# Altium project Timing Display Board v1.1.PrjPcb (part 1 of 2)
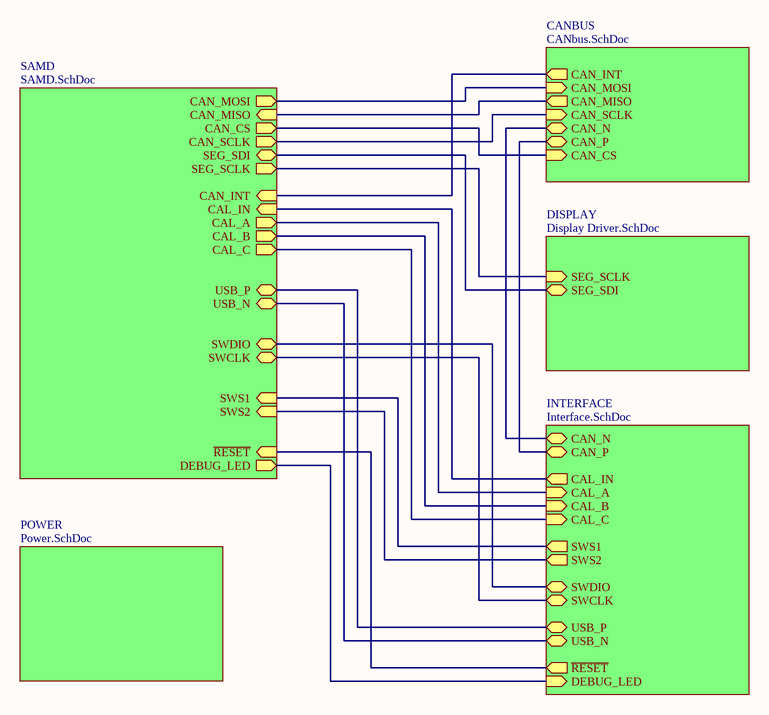
[diagram p0: Timing Display Top.SchDoc]
7 sheets, 197 parts. Net scope: hierarchical (ports join the sheet entries above them; power ports are global).
Board file: Timing Display.PcbDoc
Sheets:
  Timing Display Top.SchDoc
    SAMD = SAMD.SchDoc
    POWER = Power.SchDoc
    DISPLAY = Display Driver.SchDoc
      0 = Display.SchDoc
      1 = Display.SchDoc
      2 = Display.SchDoc
      3 = Display.SchDoc
      4 = Display.SchDoc
      5 = Display.SchDoc
      6 = Display.SchDoc
      7 = Display.SchDoc
    INTERFACE = Interface.SchDoc
    CANBUS = CANbus.SchDoc

## Sheet Timing Display Top.SchDoc
size OrCAD C; SheetNumber: 1; SheetTotal: 7

### Sub-sheets
CANBUS = CANbus.SchDoc: CAN_INT (out), CAN_MOSI (in), CAN_MISO (out), CAN_SCLK (in), CAN_CS (in), CAN_N (bidir), CAN_P (bidir)
DISPLAY = Display Driver.SchDoc: SEG_SCLK (in), SEG_SDI (bidir)
INTERFACE = Interface.SchDoc: CAL_C (in), ~{RESET} (out), CAL_A (in), SWDIO (bidir), CAL_B (in), SWCLK (bidir), CAL_IN (out), SWS2 (out), SWS1 (out), CAN_N (bidir), CAN_P (bidir), USB_N (bidir), USB_P (bidir), DEBUG_LED (in)
POWER = Power.SchDoc: no entries
SAMD = SAMD.SchDoc: CAL_IN (in), SWS2 (in), SWCLK (bidir), CAL_C (out), CAL_B (out), SWS1 (in), SEG_SDI (bidir), SWDIO (bidir), SEG_SCLK (out), ~{RESET} (in), CAL_A (out), CAN_MISO (in), CAN_SCLK (out), CAN_CS (out), CAN_MOSI (out), CAN_INT (in), USB_P (bidir), USB_N (bidir), DEBUG_LED (out)

### Nets
CAL_A: sheet SAMD/CAL_A, sheet INTERFACE/CAL_A
CAL_B: sheet SAMD/CAL_B, sheet INTERFACE/CAL_B
CAL_C: sheet SAMD/CAL_C, sheet INTERFACE/CAL_C
CAL_IN: sheet SAMD/CAL_IN, sheet INTERFACE/CAL_IN
CAN_CS: sheet SAMD/CAN_CS, sheet CANBUS/CAN_CS
CAN_INT: sheet SAMD/CAN_INT, sheet CANBUS/CAN_INT
CAN_MISO: sheet SAMD/CAN_MISO, sheet CANBUS/CAN_MISO
CAN_MOSI: sheet SAMD/CAN_MOSI, sheet CANBUS/CAN_MOSI
CAN_N: sheet INTERFACE/CAN_N, sheet CANBUS/CAN_N
CAN_P: sheet INTERFACE/CAN_P, sheet CANBUS/CAN_P
CAN_SCLK: sheet SAMD/CAN_SCLK, sheet CANBUS/CAN_SCLK
DEBUG_LED: sheet SAMD/DEBUG_LED, sheet INTERFACE/DEBUG_LED
~{RESET}: sheet SAMD/~{RESET}, sheet INTERFACE/~{RESET}
SCLK: sheet SAMD/SEG_SCLK, sheet DISPLAY/SEG_SCLK
SDI: sheet SAMD/SEG_SDI, sheet DISPLAY/SEG_SDI
SWCLK: sheet SAMD/SWCLK, sheet INTERFACE/SWCLK
SWDIO: sheet SAMD/SWDIO, sheet INTERFACE/SWDIO
SWS1: sheet SAMD/SWS1, sheet INTERFACE/SWS1
SWS2: sheet SAMD/SWS2, sheet INTERFACE/SWS2
USB_N: sheet SAMD/USB_N, sheet INTERFACE/USB_N
USB_P: sheet SAMD/USB_P, sheet INTERFACE/USB_P

## Sheet SAMD.SchDoc
size OrCAD C; SheetNumber: 5; SheetTotal: 7
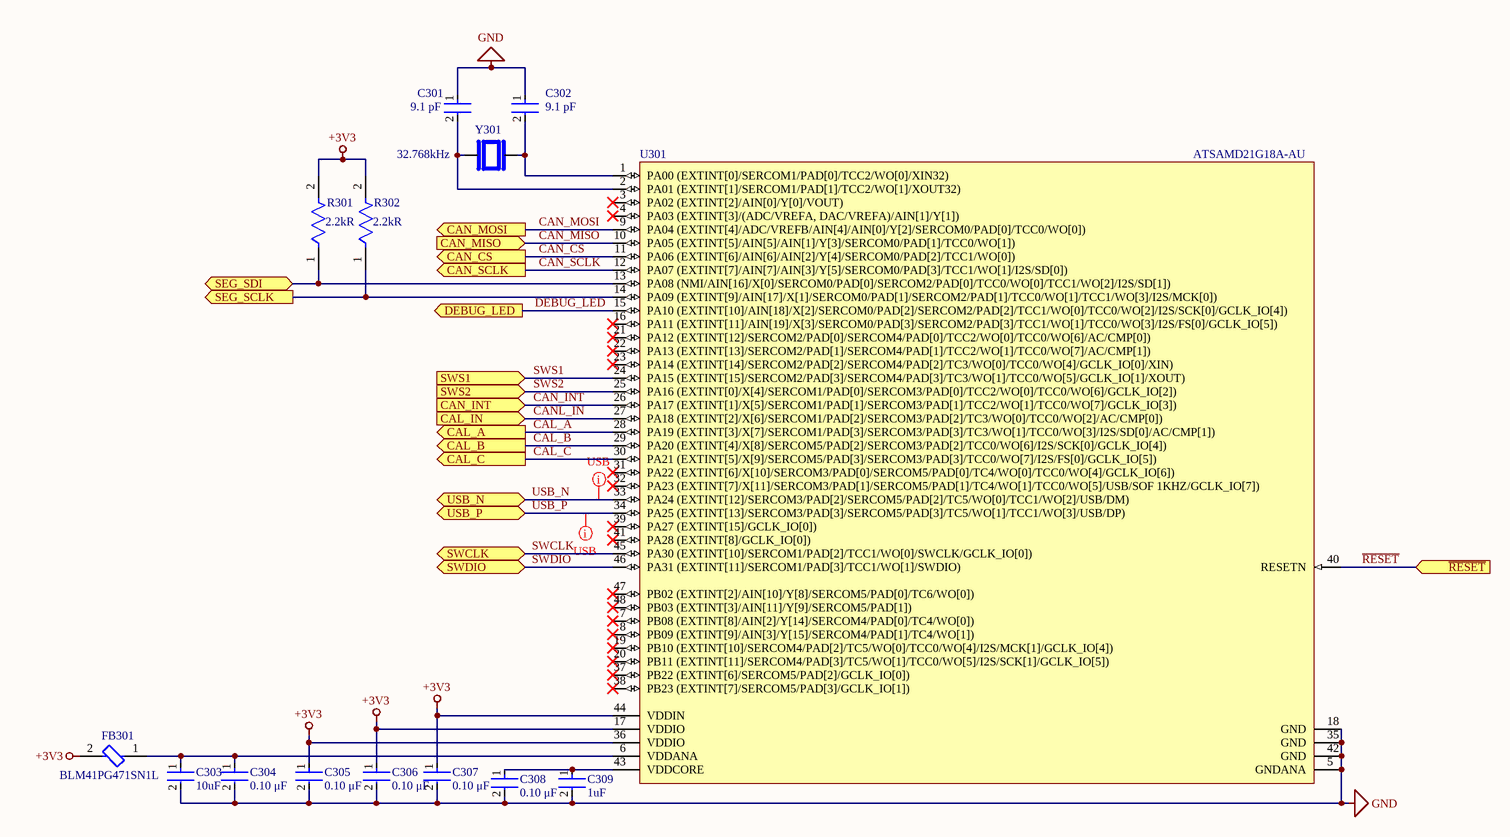
[diagram p1: SAMD.SchDoc]

### Parts
C301  Capacitance: 9.1 pF  [FP-C0402-BB-MFG]  (hidden comment: C0402C919C5GAC7867)
C302  Capacitance: 9.1 pF  [FP-C0402-BB-MFG]  (hidden comment: C0402C919C5GAC7867)
C303  Capacitance: 10uF  [FP-C1206C-EH-MFG]  (hidden comment: C1206C106K4RACAUTO)
C304  Capacitance: 0.10 μF  [FP-C0603C-CF-MFG]  (hidden comment: C0603C104K5RACAUTO)
C305  Capacitance: 0.10 μF  [FP-C0603C-CF-MFG]  (hidden comment: C0603C104K5RACAUTO)
C306  Capacitance: 0.10 μF  [FP-C0603C-CF-MFG]  (hidden comment: C0603C104K5RACAUTO)
C307  Capacitance: 0.10 μF  [FP-C0603C-CF-MFG]  (hidden comment: C0603C104K5RACAUTO)
C308  Capacitance: 0.10 μF  [FP-C0603C-CF-MFG]  (hidden comment: C0603C104K5RACAUTO)
C309  Capacitance: 1uF  [FP-C0603C-CJ-MFG]  (hidden comment: C0603C105K4RACAUTO)
FB301  BLM41PG471SN1L  [FP-BLM41-0_2-a1_2-IPC_B]
R301  Resistance: 2.2kR  [FP-CRCW0805-e3-IPC_B]  (hidden comment: CRCW08052K20FKEA)
R302  Resistance: 2.2kR  [FP-CRCW0805-e3-IPC_B]  (hidden comment: CRCW08052K20FKEA)
U301  ATSAMD21G18A-AU  [ATML-TQFP48_M]
Y301  value 32.768kHz  [XTAL_MS1V-T1K-32.768KHZ-9PF-20PPM-TA-QC-AU]  (hidden comment: MS1V-T1K-32.768KHZ-9PF-20PPM-TA-QC-AU)

### Ports
CAL_A (out), CAL_B (out), CAL_C (out), CAL_IN (in), CAN_CS (out), CAN_INT (in), CAN_MISO (in), CAN_MOSI (out), CAN_SCLK (out), DEBUG_LED (out), SEG_SCLK (out), SEG_SDI (bidir), SWCLK (bidir), SWDIO (bidir), SWS1 (in), SWS2 (in), USB_N (bidir), USB_P (bidir), ~{RESET} (in)

### Nets
+3V3: C305.1 C306.1 C307.1 FB301.2 R301.2 R302.2 U301.17(VDDIO) U301.36(VDDIO) U301.44(VDDIN)
GND: C301.1 C302.1 C303.2 C304.2 C305.2 C306.2 C307.2 C308.2 C309.2 U301.5(GNDANA) U301.18(GND) U301.35(GND) U301.42(GND)
CAL_A: U301.28(PA19_(EXTINT[3]/X[7]/SERCOM1/PAD[3]/SERCOM3/PAD[3]/TC3/WO[1]/TCC0/WO[3]/I2S/SD[0]/AC/CMP[1])) ; port CAL_A
CAL_B: U301.29(PA20_(EXTINT[4]/X[8]/SERCOM5/PAD[2]/SERCOM3/PAD[2]/TCC0/WO[6]/I2S/SCK[0]/GCLK_IO[4])) ; port CAL_B
CAL_C: U301.30(PA21_(EXTINT[5]/X[9]/SERCOM5/PAD[3]/SERCOM3/PAD[3]/TCC0/WO[7]/I2S/FS[0]/GCLK_IO[5])) ; port CAL_C
CAN_CS: U301.11(PA06_(EXTINT[6]/AIN[6]/AIN[2]/Y[4]/SERCOM0/PAD[2]/TCC1/WO[0])) ; port CAN_CS
CAN_INT: U301.26(PA17_(EXTINT[1]/X[5]/SERCOM1/PAD[1]/SERCOM3/PAD[1]/TCC2/WO[1]/TCC0/WO[7]/GCLK_IO[3])) ; port CAN_INT
CAN_MISO: U301.10(PA05_(EXTINT[5]/AIN[5]/AIN[1]/Y[3]/SERCOM0/PAD[1]/TCC0/WO[1])) ; port CAN_MISO
CAN_MOSI: U301.9(PA04_(EXTINT[4]/ADC/VREFB/AIN[4]/AIN[0]/Y[2]/SERCOM0/PAD[0]/TCC0/WO[0])) ; port CAN_MOSI
CAN_SCLK: U301.12(PA07_(EXTINT[7]/AIN[7]/AIN[3]/Y[5]/SERCOM0/PAD[3]/TCC1/WO[1]/I2S/SD[0])) ; port CAN_SCLK
CANL_IN: U301.27(PA18_(EXTINT[2]/X[6]/SERCOM1/PAD[2]/SERCOM3/PAD[2]/TC3/WO[0]/TCC0/WO[2]/AC/CMP[0])) ; port CAL_IN  [project net CAL_IN]
DEBUG_LED: U301.15(PA10_(EXTINT[10]/AIN[18]/X[2]/SERCOM0/PAD[2]/SERCOM2/PAD[2]/TCC1/WO[0]/TCC0/WO[2]/I2S/SCK[0]/GCLK_IO[4])) ; port DEBUG_LED
~{RESET}: U301.40(RESETN) ; port ~{RESET}
SCLK: R302.1 U301.14(PA09_(EXTINT[9]/AIN[17]/X[1]/SERCOM0/PAD[1]/SERCOM2/PAD[1]/TCC0/WO[1]/TCC1/WO[3]/I2S/MCK[0])) ; port SEG_SCLK
SDI: R301.1 U301.13(PA08_(NMI/AIN[16]/X[0]/SERCOM0/PAD[0]/SERCOM2/PAD[0]/TCC0/WO[0]/TCC1/WO[2]/I2S/SD[1])) ; port SEG_SDI
SWCLK: U301.45(PA30_(EXTINT[10]/SERCOM1/PAD[2]/TCC1/WO[0]/SWCLK/GCLK_IO[0])) ; port SWCLK
SWDIO: U301.46(PA31_(EXTINT[11]/SERCOM1/PAD[3]/TCC1/WO[1]/SWDIO)) ; port SWDIO
SWS1: U301.24(PA15_(EXTINT[15]/SERCOM2/PAD[3]/SERCOM4/PAD[3]/TC3/WO[1]/TCC0/WO[5]/GCLK_IO[1]/XOUT)) ; port SWS1
SWS2: U301.25(PA16_(EXTINT[0]/X[4]/SERCOM1/PAD[0]/SERCOM3/PAD[0]/TCC2/WO[0]/TCC0/WO[6]/GCLK_IO[2])) ; port SWS2
USB_N: U301.33(PA24_(EXTINT[12]/SERCOM3/PAD[2]/SERCOM5/PAD[2]/TC5/WO[0]/TCC1/WO[2]/USB/DM)) ; port USB_N
USB_P: U301.34(PA25_(EXTINT[13]/SERCOM3/PAD[3]/SERCOM5/PAD[3]/TC5/WO[1]/TCC1/WO[3]/USB/DP)) ; port USB_P
NetC301_2: C301.2 U301.2(PA01_(EXTINT[1]/SERCOM1/PAD[1]/TCC2/WO[1]/XOUT32)) Y301.1
NetC302_2: C302.2 U301.1(PA00_(EXTINT[0]/SERCOM1/PAD[0]/TCC2/WO[0]/XIN32)) Y301.2
NetC303_1: C303.1 C304.1 FB301.1 U301.6(VDDANA)
NetC308_1: C308.1 C309.1 U301.43(VDDCORE)

Not connected (* = marked no-connect by the designer): U301 3(PA02_(EXTINT[2]/AIN[0]/Y[0]/VOUT))* 4(PA03_(EXTINT[3]/(ADC/VREFA,_DAC/VREFA)/AIN[1]/Y[1]))* 7(PB08_(EXTINT[8]/AIN[2]/Y[14]/SERCOM4/PAD[0]/TC4/WO[0]))* 8(PB09_(EXTINT[9]/AIN[3]/Y[15]/SERCOM4/PAD[1]/TC4/WO[1]))* 16(PA11_(EXTINT[11]/AIN[19]/X[3]/SERCOM0/PAD[3]/SERCOM2/PAD[3]/TCC1/WO[1]/TCC0/WO[3]/I2S/FS[0]/GCLK_IO[5]))* 19(PB10_(EXTINT[10]/SERCOM4/PAD[2]/TC5/WO[0]/TCC0/WO[4]/I2S/MCK[1]/GCLK_IO[4]))* 20(PB11_(EXTINT[11]/SERCOM4/PAD[3]/TC5/WO[1]/TCC0/WO[5]/I2S/SCK[1]/GCLK_IO[5]))* 21(PA12_(EXTINT[12]/SERCOM2/PAD[0]/SERCOM4/PAD[0]/TCC2/WO[0]/TCC0/WO[6]/AC/CMP[0]))* 22(PA13_(EXTINT[13]/SERCOM2/PAD[1]/SERCOM4/PAD[1]/TCC2/WO[1]/TCC0/WO[7]/AC/CMP[1]))* 23(PA14_(EXTINT[14]/SERCOM2/PAD[2]/SERCOM4/PAD[2]/TC3/WO[0]/TCC0/WO[4]/GCLK_IO[0]/XIN))* 31(PA22_(EXTINT[6]/X[10]/SERCOM3/PAD[0]/SERCOM5/PAD[0]/TC4/WO[0]/TCC0/WO[4]/GCLK_IO[6]))* 32(PA23_(EXTINT[7]/X[11]/SERCOM3/PAD[1]/SERCOM5/PAD[1]/TC4/WO[1]/TCC0/WO[5]/USB/SOF_1KHZ/GCLK_IO[7]))* 37(PB22_(EXTINT[6]/SERCOM5/PAD[2]/GCLK_IO[0]))* 38(PB23_(EXTINT[7]/SERCOM5/PAD[3]/GCLK_IO[1]))* 39(PA27_(EXTINT[15]/GCLK_IO[0]))* 41(PA28_(EXTINT[8]/GCLK_IO[0]))* 47(PB02_(EXTINT[2]/AIN[10]/Y[8]/SERCOM5/PAD[0]/TC6/WO[0]))* 48(PB03_(EXTINT[3]/AIN[11]/Y[9]/SERCOM5/PAD[1]))*

### Layout directives
differential pair: USB_N, USB_P

### Library data of the parts
C301 C302 = CMP-03020-023776-1: C0402 9.1 pF C0G 0.25 pF 50 V; Manufacturer: Kemet; Voltage Rating: 50 V; Material: Ceramic; Temperature Coefficient: 15%; Value: 9.1 pF; Tolerance: 0.25 pF; Height: 0.55mm; Octopart: https://octopart.com/c0402c919c5gac7867-kemet-1610064; Category: Cap; Device Class L3: Ceramic Capacitors; Temperature Range Low: -55°C; RoHS: TRUE; Temperature Characteristic: C0G; ComponentLink2URL: https://content.kemet.com/datasheets/KEM_C1002_X7R_SMD.pdf; Lead Free: Yes; Temperature Range High: +125°C; Device Class L1: Passive Components; Manufacturer Part Number: C0402C919C5GAC7867; Device Class L2: Capacitors; ComponentLink2Description: Datasheet; Temperature: -55°C to +125°C; Automotive: No; Ipc Land Pattern Name: CAPC10050X50; Package: C0402-BB
C303 = CMP-03020-003375-1: CAP CER 10UF 16V X7R 1206; Manufacturer: Kemet; Material: Ceramic; Temperature Coefficient: 15%; Tolerance: 10%; Automotive Grade: Grade 1; Manufacturer Part Number: C1206C106K4RACAUTO; Digikey Description: CAP CER 10UF 16V X7R 1206; RoHS: TRUE; Temperature Range Low: -55°C; Ipc Land Pattern Name: CAPC320160X160; Category: Cap; Mouser Description: Multilayer Ceramic Capacitors MLCC - SMD/SMT 10uF 16V 10% AUTO; Device Class L1: Passive Components; Automotive: Yes; ComponentLink2Description: Datasheet; Octopart: https://octopart.com/c1206c106k4racauto-kemet-20072893; Package: C1206C-EH; Temperature: -55°C to +125°C; Device Class L3: Ceramic Capacitors; Device Class L2: Capacitors; Temperature Range High: +125°C; Value: 10uF; Lead Free: Yes; Height: 1.8mm; Temperature Characteristic: X7R; ComponentLink2URL: https://content.kemet.com/datasheets/KEM_C1023_X7R_AUTO_SMD.pdf; Voltage Rating: 16V
C304-C308 = CMP-2006-03060-2: CAP CER 0.1UF 50V X7R 0603; Manufacturer: KEMET; Tolerance: 0.1; Material: Ceramic; Value: 0.10 μF; Automotive Grade: Grade 1; Temperature Coefficient: 30ppm/°C; RoHS: TRUE; Temperature Range Low: -55°C; Automotive: Yes; Octopart: https://octopart.com/c0603c104k5racauto-kemet-12563741; Temperature Characteristic: X7R; Category: Cap; Voltage Rating: 50 V; Mouser Description: Multilayer Ceramic Capacitors MLCC - SMD/SMT 0.1uF 50volts 10% X7R AUTO; ComponentLink2Description: Datasheet; Device Class L2: Capacitors; Digikey Description: CAP CER 0.1UF 50V X7R 0603; Manufacturer Part Number: C0603C104K5RACAUTO; ComponentLink2URL: https://api.kemet.com/component-edge/download/datasheet/C0603C100J5GACAUTO.pdf; Lead Free: Yes; Height: 0.87mm; Device Class L3: Ceramic Capacitors; Device Class L1: Passive Components; Temperature Range High: +125°C; Package: C0603C-CF; Temperature: -55°C to +125°C
C309 = CMP-03020-014193-1: CAP CER 0603 1UF 16V X7R 10%; Manufacturer: KEMET; Temperature Coefficient: 15%; Automotive Grade: Grade 1; Material: Ceramic; Digikey Description: CAP CER 0603 1UF 16V X7R 10%; Octopart: https://octopart.com/c0603c105k4racauto-kemet-91328491; Package: C0603C-CJ; ComponentLink2Description: Datasheet; Mouser Description: Cap Ceramic 1uF 16V X7R 10% Pad SMD 0603 125C Automotive T/R; Automotive: Yes; Tolerance: 10%; Manufacturer Part Number: C0603C105K4RACAUTO; Lead Free: Yes; Temperature: -55°C to +125°C; ComponentLink2URL: https://content.kemet.com/datasheets/KEM_C1023_X7R_AUTO_SMD.pdf; Temperature Range Low: -55°C; Ipc Land Pattern Name: CAPC16080X80; Device Class L1: Passive Components; Temperature Characteristic: X7R; Device Class L2: Capacitors; Height: 0.95mm; Device Class L3: Ceramic Capacitors; RoHS: TRUE; Category: Cap; Temperature Range High: +125°C; Value: 1uF; Voltage Rating: 16V
FB301 = CMP-0686-00760-3: Ferrite Bead, 1806, 470Ω @ 100MHz, 25%, 0.05Ω, 2A; Material: Steel; Number of Circuits: 1; Shielding: Unshielded; DC Resistance (DCR): 50mR; Impedance: 470R; Min Operating Temperature: -55°C; Case/Package: 1806; Packaging: Tape and Reel; DC Current: 2A; Frequency: 100MHz; Length: 4.5mm; Max Operating Temperature: 125°C; Package Quantity: 1; Max Current Rating: 2A; Radiation Hardening: No; RoHS Compliant: Yes; Lead Free: Lead Free; Height: 1.6mm; Test Frequency: 100MHz; Series: BLM41P; Width: 1.6mm; Core Material: Ferrite; Case Code (Imperial): 1806; Termination: SMD/SMT; Tolerance: 25%; Number of Pins: 2; Number of Lines: 1; Case Code (Metric): 4516; Current Rating: 2A; Max DC Current: 2A; DC Resistance-Max: 50mR; Depth: 1.6mm; Military Standard: Not
R301 R302 = CMP-2001-03760-2: RES Thick Film, 2.2kΩ, 1%, 0.125W, 100ppm/°C, 0805; Voltage Rating (DC): 150V; Max Power Dissipation: 125mW; Case/Package: 0805; Width: 1.25mm; Voltage Rating: 150V; Composition: Thick Film; Power Rating: 125mW; Packaging: Tape and Reel; Min Operating Temperature: -55°C; Contact Plating: Tin; Tolerance: 1%; Military Standard: Not; Case Code (Metric): 2012; Radiation Hardening: No; Termination: SMD/SMT; Lead Free: Lead Free; Case Code (Imperial): 0805; Max Operating Temperature: 155°C; Depth: 1.25mm; Weight: 0.000194oz; Number of Terminations: 2; Length: 2mm; Package Quantity: 10; Temperature Coefficient: 100ppm/°C; Features: Automotive AEC-Q200; Height: 0.45mm
U301 = CMP-2100-03585-1: SMART ARM-Based Microcontroller, 1.62 to 3.63 V, 256 KB Flash, 32 KB SRAM, -40 to 85 degC, 48-Pin TQFP, RoHS, Tray; Manufacturer: Atmel; Max Frequency: 48MHz; Number of Timers/Counters: 6; Max Supply Voltage: 3.63V; Min Supply Voltage: 1.62V; Packaging: Tray; Datasheet Version: Rev. N, 10/2016; Datasheet URL: http://www.atmel.com/images/atmel-42181-sam-d21_datasheet.pdf; REACH SVHC: NoSVHC; RoHSCompliant: true; Max Operating Temperature: 85degC; Manufacturer URL: http://www.atmel.com/; Contact Plating: Tin; Frequency: 48MHz; Package Description: 48-Pin Thin Profile Plastic Quad Flat Package, Body 7 x 7 mm, Pitch 0.5 mm; Package Reference: TQFP48; Lead Free: LeadFree; Number of Pins: 48; Min Operating Temperature: -40degC; Case/Package: TQFP; Mount: SurfaceMount
Y301 = MS1V-T1K-32.768KHZ-9PF-20PPM-TA-QC-AU: Tuning Fork Crystal 30 kHz â€“ 200 kHz; MF: {'manufacturer': u'Micro Crystal AG'}; Package: None; MP: MS1V-T1K-32.768KHZ-9PF-20PPM-TA-QC-AU; Availability: Unavailable; Price: None

## Sheet Power.SchDoc
size 431 x 279 mm; SheetNumber: 2; SheetTotal: 7
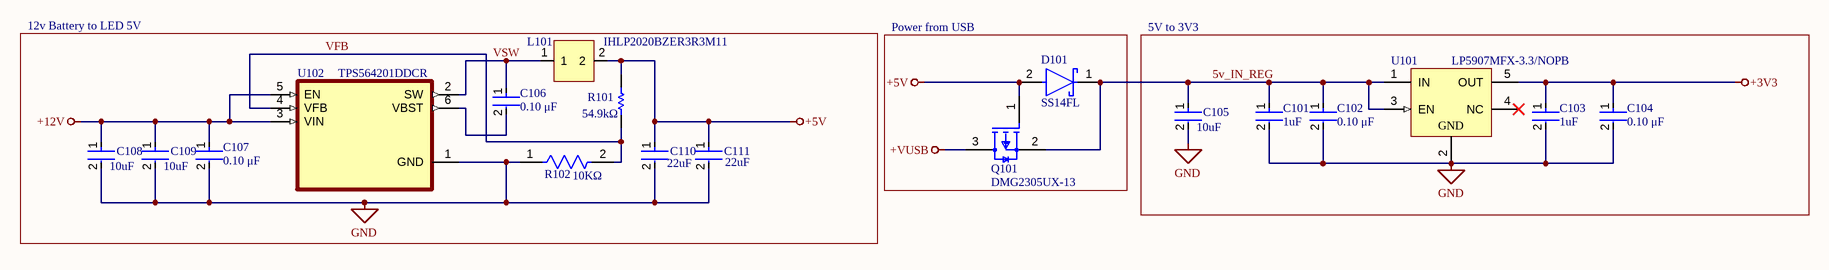
[diagram p2: Power.SchDoc]

### Parts
C101  Capacitance: 1uF  [FP-C0603C-CJ-MFG]  (hidden comment: C0603C105K4RACAUTO)
C102  Capacitance: 0.10 μF  [FP-C0603C-CF-MFG]  (hidden comment: C0603C104K5RACAUTO)
C103  Capacitance: 1uF  [FP-C0603C-CJ-MFG]  (hidden comment: C0603C105K4RACAUTO)
C104  Capacitance: 0.10 μF  [FP-C0603C-CF-MFG]  (hidden comment: C0603C104K5RACAUTO)
C105  Capacitance: 10uF  [FP-GRM31C-0_2-e0_3_0_8-MFG]  (hidden comment: GRM31CR71E106KA12K)
C106  Capacitance: 0.10 μF  [FP-C0603C-CF-MFG]  (hidden comment: C0603C104K5RACAUTO)
C107  Capacitance: 0.10 μF  [FP-C0603C-CF-MFG]  (hidden comment: C0603C104K5RACAUTO)
C108  Capacitance: 10uF  [FP-GRM31C-0_2-e0_3_0_8-MFG]  (hidden comment: GRM31CR71E106KA12K)
C109  Capacitance: 10uF  [FP-GRM31C-0_2-e0_3_0_8-MFG]  (hidden comment: GRM31CR71E106KA12K)
C110  value 22uF  [FP-CL31H-0_2-MFG]  (hidden comment: CL31A226KAHNNNE)
C111  value 22uF  [FP-CL31H-0_2-MFG]  (hidden comment: CL31A226KAHNNNE)
D101  SS14FL  [FP-425AD-MFG]
L101  IHLP2020BZER3R3M11  [IHLP2020BZER3R3M11]
Q101  DMG2305UX-13  [FP-SOT23-MFG]
R101  value 54.9kΩ  [RESC1608X55X30LL15T15]  (hidden comment: ERJ-3EKF5492V)
R102  Resistance: 10KΩ  [FP-AC0603-MFG]  (hidden comment: AC0603FR-0710KL)
U101  LP5907MFX-3.3/NOPB  [DBV0005A_N]
U102  TPS564201DDCR  [SOT95P280X110-6N]

### Blocks framed on the sheet
12v Battery to LED 5V: C106-C111 L101 R101 R102 U102
Power from USB: D101 Q101
5V to 3V3: C101-C105 U101

### Nets
+3V3: C103.1 C104.1 U101.5(OUT)
+5V: C110.1 C111.1 D101.2(A) L101.2 Q101.1(G) R101.2
+12V: C107.1 C108.1 C109.1 U102.3(VIN) U102.5(EN)
+VUSB: Q101.3(D)
GND: C101.2 C102.2 C103.2 C104.2 C105.2 C107.2 C108.2 C109.2 C110.2 C111.2 R102.1 U101.2(GND) U102.1(GND)
5v_IN_REG: C101.1 C102.1 C105.1 D101.1(C) Q101.2(S) U101.1(IN) U101.3(EN)
VFB: R101.1 R102.2 U102.4(VFB)
VSW: C106.1 L101.1 U102.2(SW)
NetC106_2: C106.2 U102.6(VBST)

Not connected (* = marked no-connect by the designer): U101 4(NC)*

### Notes on the sheet
- DWG. NO.
- REV.
- SHT.
- THIS DOCUMENT AND THE DATA DISCLOSED HEREIN OR HEREWITH IS THE PROPERTY OF ALTIUM LIMITED AND MAY BE FREELY DISTRIBUTED IN WHOLE. NO RIGHTS ARE RESERVED OR EXPRESS OR IMPLIED WARANTEE GIVEN.
- REVISION
- DESCRIPTION
- DATE
- APPROVED
- ENG:
- APPROVALS
- PROJECT
- DSN:
- CHK:
- REFERENCE DOCUMENTS
- PROJECT REVISION:
- TITLE
- DOCUMENT REVISION:
- DESIGN ITEM:
- BOM:
- FAB DWG:
- PCB DWG:
- ASSY DWG:
- SCALE:
- SIZE
- B
- CAGE CODE
- FILE NAME
- DWG NO.
- SHEET
- OF
- REV

### Library data of the parts
C101 C103 = CMP-03020-014193-1: as C309 on sheet SAMD; Digikey Description: CAP CER 0603 1UF 16V X7R 10%; Octopart: https://octopart.com/c0603c105k4racauto-kemet-91328491; Package: C0603C-CJ; ComponentLink2Description: Datasheet; Mouser Description: Cap Ceramic 1uF 16V X7R 10% Pad SMD 0603 125C Automotive T/R; Automotive: Yes; Tolerance: 10%; Manufacturer Part Number: C0603C105K4RACAUTO; Lead Free: Yes; Temperature: -55°C to +125°C; ComponentLink2URL: https://content.kemet.com/datasheets/KEM_C1023_X7R_AUTO_SMD.pdf; Temperature Range Low: -55°C; Ipc Land Pattern Name: CAPC16080X80; Device Class L1: Passive Components; Temperature Characteristic: X7R; Device Class L2: Capacitors; Height: 0.95mm; Device Class L3: Ceramic Capacitors; RoHS: TRUE; Category: Cap; Temperature Range High: +125°C; Value: 1uF; Voltage Rating: 16V
C102 C104 C106 C107 = CMP-2006-03060-2: as C304 on sheet SAMD; RoHS: TRUE; Temperature Range Low: -55°C; Automotive: Yes; Octopart: https://octopart.com/c0603c104k5racauto-kemet-12563741; Temperature Characteristic: X7R; Category: Cap; Voltage Rating: 50 V; Mouser Description: Multilayer Ceramic Capacitors MLCC - SMD/SMT 0.1uF 50volts 10% X7R AUTO; ComponentLink2Description: Datasheet; Device Class L2: Capacitors; Digikey Description: CAP CER 0.1UF 50V X7R 0603; Manufacturer Part Number: C0603C104K5RACAUTO; ComponentLink2URL: https://api.kemet.com/component-edge/download/datasheet/C0603C100J5GACAUTO.pdf; Lead Free: Yes; Height: 0.87mm; Device Class L3: Ceramic Capacitors; Device Class L1: Passive Components; Temperature Range High: +125°C; Package: C0603C-CF; Temperature: -55°C to +125°C
C105 C108 C109 = CMP-06035-005515-1: Chip Multilayer Ceramic Capacitors for General Purpose, 1206, 10uF, X7R, 15%, 10%, 25V; Dielectric: X7R; Max Operating Temperature: 125°C; Voltage Rating (DC): 25V; Case/Package: 1206; Thickness: 0.071inch; Tolerance: 10%; Voltage Rating: 25V; Mount: Surface Mount; Width: 0.063inch; Length: 0.126inch; Min Operating Temperature: -55°C; Packaging: Tape and Reel; Lead Free: Lead Free; Voltage: 25V
C110 C111 = CMP-13271-000012-1: CAP CER 22UF 25V X5R 1206; Manufacturer: Samsung; Temperature Coefficient: 15%; Tolerance: 10%; Material: Ceramic; Automotive: No; Device Class L3: Ceramic Capacitors; Temperature: -55°C to +85°C; Octopart: https://octopart.com/cl31a226kahnnne-samsung-19832795; Temperature Range Low: -55°C; Voltage Rating: 25V; Height: 1.8mm; Temperature Characteristic: X5R; Package: CL31H-0.2; Temperature Range High: +85°C; ComponentLink2URL: http://www.samsungsem.com/kr/support/product-search/mlcc/__icsFiles/afieldfile/2019/05/10/19-CL31A226KAHNNNE.pdf; Ipc Land Pattern Name: CAPC320160X160; Lead Free: Yes; Device Class L2: Capacitors; Device Class L1: Passive Components; Capacitance: 22uF; Digikey Description: CAP CER 22UF 25V X5R 1206; Manufacturer Part Number: CL31A226KAHNNNE; RoHS: TRUE; Category: Cap; ComponentLink2Description: Datasheet
D101 = CMP-07162-000013-1: DIODE SCHOTTKY 40V 1A SOD123F; Manufacturer: ON Semiconductor; Max Junction Temp: +125°C; Value: 60pF; Max Surge Forward Current: 40A; Peak Reverse Current: 30uA; Device Class L3: Schottky Diodes; Reverse Voltage: 40V; Automotive: No; Temperature: -55°C to +125°C; Mouser Description: SS14FL Series 40 V 1 A Surface Mount Schottky Barrier Rectifier - SOD-123F; Octopart: https://octopart.com/ss14fl-on+semiconductor-84331601; Height: 1.08mm; Temperature Range Low: -55°C; Category: Diode; Lead Free: Yes; Device Class L1: Discrete Semiconductors; Digikey Description: DIODE SCHOTTKY 40V 1A SOD123F; RoHS: TRUE; ComponentLink2Description: Datasheet; Manufacturer Part Number: SS14FL; Forward Current: 1A; Capacitance: 60pF; Package: 425AD; Device Class L2: Diodes; Temperature Range High: +125°C; Max Repetitive Reverse Voltage: 40V; ComponentLink2URL: https://www.onsemi.com/pub/Collateral/SS14FL-D.PDF
Q101 = CMP-12801-000021-1: MOSFET P-CH 20V 4.2A SOT23; Manufacturer: Diodes Inc.; Input Capacitace At Vds: 808pF @ -15V; Rthja Max: 90°C/W; Drain To Source Voltage: -20V; Standoff Height: 0.013mm; Number Of P Channels: 1; Gate To Source Voltage: 8V; Turn On Delay Time: 10.8ns; Pulse Drain Current: -15A; Threshold Vgs Max: -0.9V; Max Junction Temp: +150°C; Depletion Mode: False; Drain To Source Resistance: 40mΩ; Threshold Vgs Min: -0.5V; Continuous Drain Current: -4.2A; Turn Off Delay Time: 79.3ns; Gate Charge At Vgs: 10.2nC @ -4.5V; Power Dissipation: 1.4W; Digikey Description: MOSFET P-CH 20V 4.2A SOT23; Temperature Range High: +150°C; Height: 1.1mm; Package: SOT23; Footprint Url: https://www.diodes.com/assets/Package-Files/SOT23.pdf; Device Class L3: MOSFETs; RoHS: TRUE; Temperature: -55°C to +150°C; Mouser Description: MOSFET P-Ch ENH FET -20V 52mOhm -5.0V; Temperature Range Low: -55°C; ComponentLink2Description: Datasheet; Manufacturer Part Number: DMG2305UX-13; Octopart: https://octopart.com/dmg2305ux-13-diodes+inc.-29925594; Ipc Land Pattern Name: SOT92P240X102-3; Device Class L2: Transistors; Automotive: No; Number Of Channels: 1; Drain To Source Breakdown Voltage: -20V; Lead Free: Yes; Device Class L1: Discrete Semiconductors; Category: Trans; ComponentLink2URL: https://www.diodes.com/assets/Datasheets/DMG2305UX.pdf
R101 = CMP-2000-00561-1: Manufacturer: Panasonic; Part Number: ERJ-3EKF5492V
R102 = CMP-2000-04818-2: RES SMD 10K OHM 1% 1/10W 0603; Manufacturer: Yageo; Value: 10KΩ; Automotive Grade: Grade 0; Tolerance: 0.01; Power Rating: 0.1W; Voltage Rating: 75V; Automotive: Yes; Device Class L2: Resistors; Device Class L1: Passive Components; Footprint Url: http://www.yageo.com/exep/pages/download/literatures/PYu-R_Mount_9.pdf; Temperature Range High: +155°C; Composition: Thick Film; Height: 0.55mm; Series: AC; Mouser Description: Fixed Resistor, Metal Glaze/thick Film, 0.1W, 10000ohm, 50V, 1% +/-Tol, 100ppm/Cel, Surface Mount, 0603; RoHS: TRUE; Manufacturer Part Number: AC0603FR-0710KL; Lead Free: Yes; Package: AC0603; Ipc Land Pattern Name: RESC16080X45; Octopart: https://octopart.com/ac0603fr-0710kl-yageo-21711091; ComponentLink2URL: http://www.yageo.com/NewPortal/yageodocoutput?fileName=/pdf/R-Chip/PYu-AC_51_RoHS_L_6.pdf; Digikey Description: RES SMD 10K OHM 1% 1/10W 0603; Temperature Range Low: -55°C; Temperature: -55°C to +155°C; ComponentLink2Description: Datasheet; Category: Res; Device Class L3: Chip SMD Resistors
U101 = CMP-2000-07464-2: None; Power Supply Rejection Ratio (PSRR): 82dB; Accuracy: 2%; Output Type: Fixed; Min Input Voltage: 2.2V; Quiescent Current: 425uA; Max Output Current: 250mA; Output Voltage: 3.3V; Number of Outputs: 1; Polarity: Positive; Max Input Voltage: 5.5V; Dropout Voltage: 250mV; Output Voltage Accuracy: 2%; RoHS Compliant: Yes; Max Operating Temperature: 125°C; Contact Plating: Tin; Number of Pins: 5; Lead Free: Lead Free; Radiation Hardening: No; Mount: Surface Mount; Nominal Output Voltage: 3.3V; Case/Package: SOT-23; Packaging: Tape and Reel; Number of Regulators: 1; Min Operating Temperature: -40°C; Package Quantity: 3000; REACH SVHC: No SVHC; Output Current: 250mA
U102 = TPS564201DDCR: MF: {'manufacturer': u'Texas Instruments'}; Package: None; MP: TPS564201DDCR; Value: *; Availability: Unavailable; Price: None
L101 = IHLP2020BZER3R3M11: Supplier 1: Mouser; Supplier Part Number 1: 70-IHLP2020BZER3R3M1

## Sheet Display Driver.SchDoc
size 431 x 279 mm; SheetNumber: 3; SheetTotal: 7
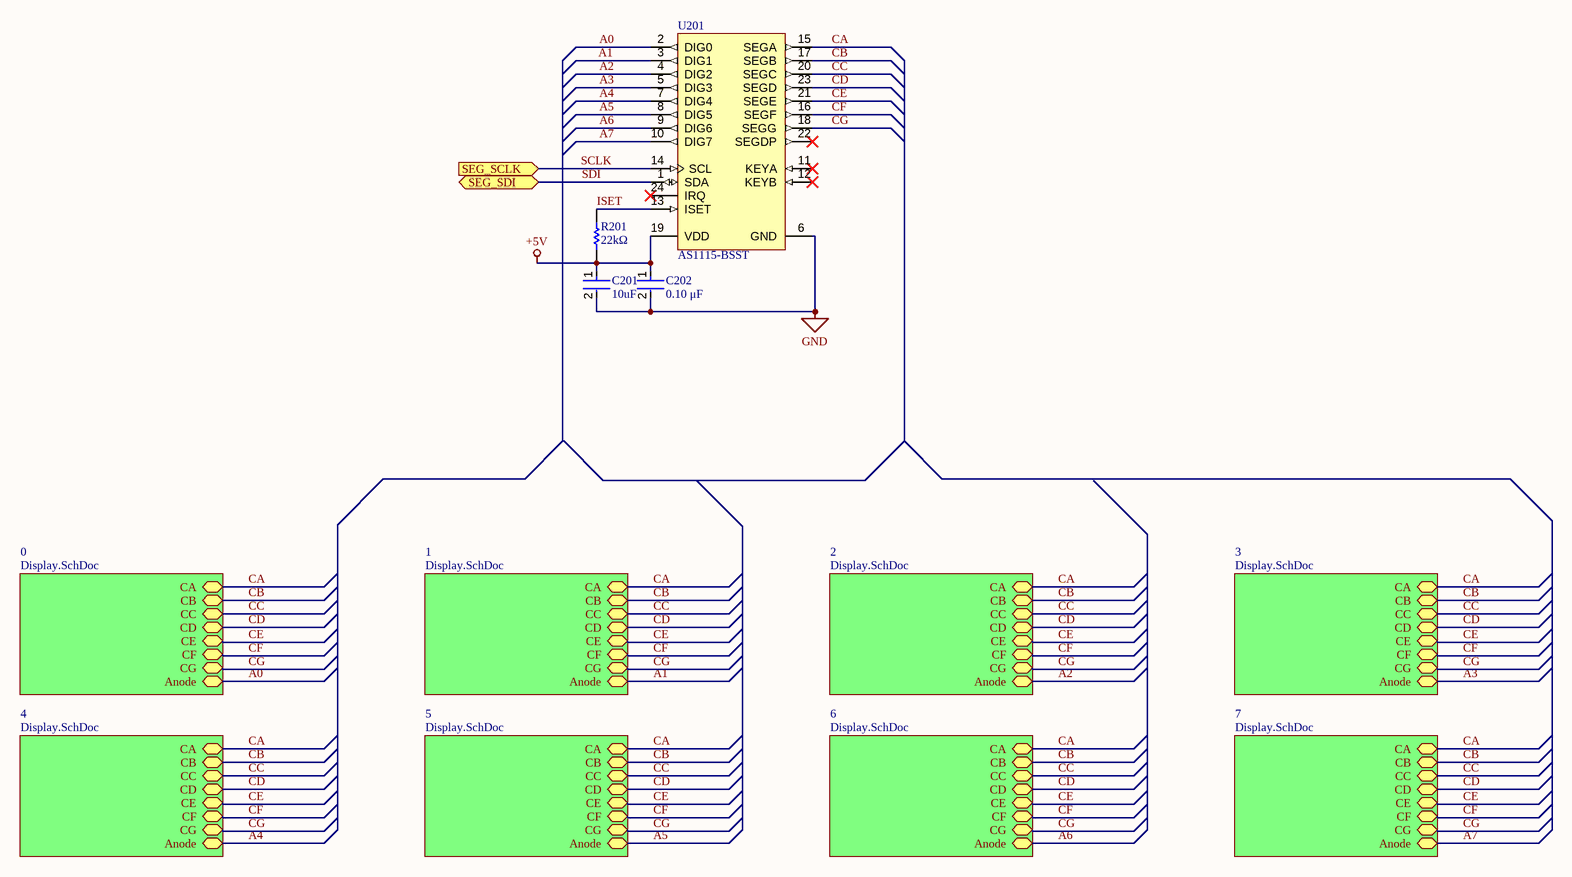
[diagram p3: Display Driver.SchDoc]

### Parts
C201  Capacitance: 10uF  [FP-C1206C-EH-MFG]  (hidden comment: C1206C106K4RACAUTO)
C202  Capacitance: 0.10 μF  [FP-C0603C-CF-MFG]  (hidden comment: C0603C104K5RACAUTO)
R201  Resistance: 22kΩ  [RESC1608X55X25LL10T15]  (hidden comment: RC0603FR-0722KL)
U201  AS1115-BSST  [AMS-QSOP-24-8645X3900DE_N]

### Sub-sheets
0 = Display.SchDoc: CA (bidir), CB (bidir), CC (bidir), CD (bidir), CE (bidir), CF (bidir), CG (bidir), Anode (bidir)
1 = Display.SchDoc: CA (bidir), CB (bidir), CC (bidir), CD (bidir), CE (bidir), CF (bidir), CG (bidir), Anode (bidir)
2 = Display.SchDoc: CA (bidir), CB (bidir), CC (bidir), CD (bidir), CE (bidir), CF (bidir), CG (bidir), Anode (bidir)
3 = Display.SchDoc: CA (bidir), CB (bidir), CC (bidir), CD (bidir), CE (bidir), CF (bidir), CG (bidir), Anode (bidir)
4 = Display.SchDoc: CA (bidir), CB (bidir), CC (bidir), CD (bidir), CE (bidir), CF (bidir), CG (bidir), Anode (bidir)
5 = Display.SchDoc: CA (bidir), CB (bidir), CC (bidir), CD (bidir), CE (bidir), CF (bidir), CG (bidir), Anode (bidir)
6 = Display.SchDoc: CA (bidir), CB (bidir), CC (bidir), CD (bidir), CE (bidir), CF (bidir), CG (bidir), Anode (bidir)
7 = Display.SchDoc: CA (bidir), CB (bidir), CC (bidir), CD (bidir), CE (bidir), CF (bidir), CG (bidir), Anode (bidir)

### Ports
SEG_SCLK (in), SEG_SDI (bidir)

### Nets
+5V: C201.1 C202.1 R201.1 U201.19(VDD)
GND: C201.2 C202.2 U201.6(GND)
A0: U201.2(DIG0) ; sheet 0/Anode
A1: U201.3(DIG1) ; sheet 1/Anode
A2: U201.4(DIG2) ; sheet 2/Anode
A3: U201.5(DIG3) ; sheet 3/Anode
A4: U201.7(DIG4) ; sheet 4/Anode
A5: U201.8(DIG5) ; sheet 5/Anode
A6: U201.9(DIG6) ; sheet 6/Anode
A7: U201.10(DIG7) ; sheet 7/Anode
CA: U201.15(SEGA) ; sheet 0/CA, sheet 1/CA, sheet 2/CA, sheet 3/CA, sheet 4/CA, sheet 5/CA, sheet 6/CA, sheet 7/CA
CB: U201.17(SEGB) ; sheet 0/CB, sheet 1/CB, sheet 2/CB, sheet 3/CB, sheet 4/CB, sheet 5/CB, sheet 6/CB, sheet 7/CB  [project net Cathode_B]
CC: U201.20(SEGC) ; sheet 0/CC, sheet 1/CC, sheet 2/CC, sheet 3/CC, sheet 4/CC, sheet 5/CC, sheet 6/CC, sheet 7/CC  [project net Cathode_C]
CD: U201.23(SEGD) ; sheet 0/CD, sheet 1/CD, sheet 2/CD, sheet 3/CD, sheet 4/CD, sheet 5/CD, sheet 6/CD, sheet 7/CD  [project net Cathode_D]
CE: U201.21(SEGE) ; sheet 0/CE, sheet 1/CE, sheet 2/CE, sheet 3/CE, sheet 4/CE, sheet 5/CE, sheet 6/CE, sheet 7/CE  [project net Cathode_E]
CF: U201.16(SEGF) ; sheet 0/CF, sheet 1/CF, sheet 2/CF, sheet 3/CF, sheet 4/CF, sheet 5/CF, sheet 6/CF, sheet 7/CF  [project net Cathode_F]
CG: U201.18(SEGG) ; sheet 0/CG, sheet 1/CG, sheet 2/CG, sheet 3/CG, sheet 4/CG, sheet 5/CG, sheet 6/CG, sheet 7/CG  [project net Cathode_G]
ISET: R201.2 U201.13(ISET)
SCLK: U201.14(SCL) ; port SEG_SCLK
SDI: U201.1(SDA) ; port SEG_SDI

Not connected (* = marked no-connect by the designer): U201 11(KEYA)* 12(KEYB)* 22(SEGDP)* 24(IRQ)*

### Notes on the sheet
- DWG. NO.
- REV.
- SHT.
- THIS DOCUMENT AND THE DATA DISCLOSED HEREIN OR HEREWITH IS THE PROPERTY OF ALTIUM LIMITED AND MAY BE FREELY DISTRIBUTED IN WHOLE. NO RIGHTS ARE RESERVED OR EXPRESS OR IMPLIED WARANTEE GIVEN.
- REVISION
- DESCRIPTION
- DATE
- APPROVED
- ENG:
- APPROVALS
- PROJECT
- DSN:
- CHK:
- REFERENCE DOCUMENTS
- PROJECT REVISION:
- TITLE
- DOCUMENT REVISION:
- DESIGN ITEM:
- BOM:
- FAB DWG:
- PCB DWG:
- ASSY DWG:
- SCALE:
- SIZE
- B
- CAGE CODE
- FILE NAME
- DWG NO.
- SHEET
- OF
- REV

### Library data of the parts
C201 = CMP-03020-003375-1: as C303 on sheet SAMD; Manufacturer Part Number: C1206C106K4RACAUTO; Digikey Description: CAP CER 10UF 16V X7R 1206; RoHS: TRUE; Temperature Range Low: -55°C; Ipc Land Pattern Name: CAPC320160X160; Category: Cap; Mouser Description: Multilayer Ceramic Capacitors MLCC - SMD/SMT 10uF 16V 10% AUTO; Device Class L1: Passive Components; Automotive: Yes; ComponentLink2Description: Datasheet; Octopart: https://octopart.com/c1206c106k4racauto-kemet-20072893; Package: C1206C-EH; Temperature: -55°C to +125°C; Device Class L3: Ceramic Capacitors; Device Class L2: Capacitors; Temperature Range High: +125°C; Value: 10uF; Lead Free: Yes; Height: 1.8mm; Temperature Characteristic: X7R; ComponentLink2URL: https://content.kemet.com/datasheets/KEM_C1023_X7R_AUTO_SMD.pdf; Voltage Rating: 16V
C202 = CMP-2006-03060-2: as C304 on sheet SAMD; RoHS: TRUE; Temperature Range Low: -55°C; Automotive: Yes; Octopart: https://octopart.com/c0603c104k5racauto-kemet-12563741; Temperature Characteristic: X7R; Category: Cap; Voltage Rating: 50 V; Mouser Description: Multilayer Ceramic Capacitors MLCC - SMD/SMT 0.1uF 50volts 10% X7R AUTO; ComponentLink2Description: Datasheet; Device Class L2: Capacitors; Digikey Description: CAP CER 0.1UF 50V X7R 0603; Manufacturer Part Number: C0603C104K5RACAUTO; ComponentLink2URL: https://api.kemet.com/component-edge/download/datasheet/C0603C100J5GACAUTO.pdf; Lead Free: Yes; Height: 0.87mm; Device Class L3: Ceramic Capacitors; Device Class L1: Passive Components; Temperature Range High: +125°C; Package: C0603C-CF; Temperature: -55°C to +125°C
R201 = CMP-1012-00659-3: Chip Resistor, 22 KOhm, +/- 1%, 0.1 W, -55 to 155 degC, 0603 (1608 Metric), RoHS, Tape and Reel; Tolerance: 10%; Current Rating: 290 mA; Shielding: Unshielded; PackageReference: 0603; PackageDescription: 2-Pin Surface Mount Device, Body 1.6 x 0.8 mm; ComponentLink2URL: http://www.yageo.com/documents/recent/PYu-RC_Group_51_RoHS_L_04.pdf; RoHSCompliant: True; REACH SVHC: No SVHC; ComponentLink1Description: Manufacturer URL; ComponentLink2Description: Datasheet; DatasheetVersion: Rev. 4, 02/2016; Min Operating Temperature: -55degC; Pins: 2; Mount: Through Hole; Height: 11 mm; Packaging: Bulk; Radiation Hardening: No; Package Quantity: 100; Diameter: 8.5 mm; Lead Pitch: 5 mm; Case/Package: Radial; Max Operating Temperature: 105degC; ComponentLink1URL: http://www.yageo.com/
U201 = CMP-0558-00023-2: 64 LED + 16 Keys User Interface LED Driver, I2C Interface, 2.7 to 5.5 V, QSOP-24, Pb-Free, Reel; Manufacturer: AMS; Read-back: TRUE; LED Current per Output (mA): 5; Outputs: 64; LED-to-LED Matching (%): 3; ComponentLink1URL: www.ams.com; DatasheetVersion: Rev. 1.08; PackageVersion: Rev. 1.07, 04/2010; Supply Voltage (V): 2.7 to 5.5; PackageReference: QSOP-24; ComponentLink1Description: Manufacturer URL; Features: multiplexed; IÂ²C interface; PartNumber: AS1115-BSST; ComponentLink2Description: Datasheet; ComponentLink2URL: http://www.ams.com/eng/content/download/18430/343782/15670; Mounting Technology: Surface Mount; Error Detection: TRUE; PackageDescription: 24-Pin Small Outline Package, 8.645 x 3.9 mm Body, 0.635 mm Pitch

## Sheet Display.SchDoc
size 431 x 279 mm; Organization: ORGANIZATION; Address1: ADDRESS 1; Address2: ADDRESS 2; Address3: ADDRESS 3; Address4: ADDRESS 4; Revision: -; SheetNumber: 4; SheetTotal: 7; ENG_APP_DATE: --/--/--; DSN_APP_DATE: --/--/--; CHK_APP_DATE: --/--/--
Used 8 times, as channels DISPLAY/0, DISPLAY/1, DISPLAY/2, DISPLAY/3, DISPLAY/4, DISPLAY/5, DISPLAY/6, DISPLAY/7. Parts and nets are listed once, with the designators drawn on the sheet.
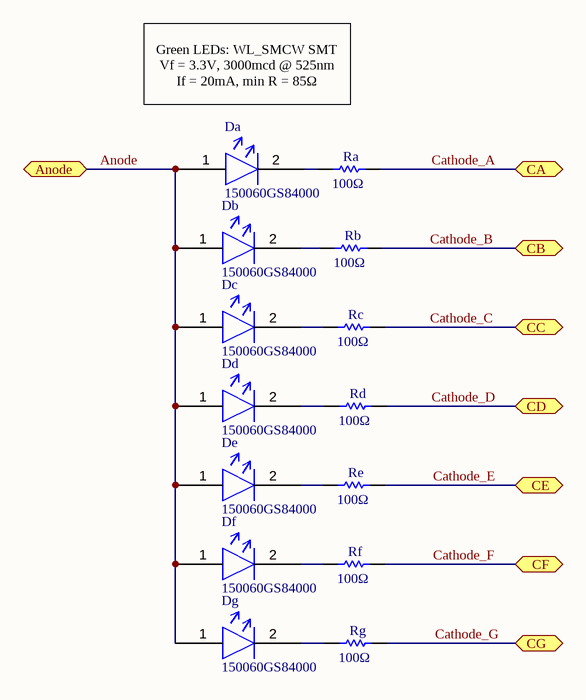
[diagram p4: Display.SchDoc]

### Parts
Da  150060GS84000  [DIOC2408X10N]
Db  150060GS84000  [DIOC2408X10N]
Dc  150060GS84000  [DIOC2408X10N]
Dd  150060GS84000  [DIOC2408X10N]
De  150060GS84000  [DIOC2408X10N]
Df  150060GS84000  [DIOC2408X10N]
Dg  150060GS84000  [DIOC2408X10N]
Ra  value 100Ω  [RESC1005X40X25NL05T10]  (hidden comment: RC0402FR-13100RL)
Rb  value 100Ω  [RESC1005X40X25NL05T10]  (hidden comment: RC0402FR-13100RL)
Rc  value 100Ω  [RESC1005X40X25NL05T10]  (hidden comment: RC0402FR-13100RL)
Rd  value 100Ω  [RESC1005X40X25NL05T10]  (hidden comment: RC0402FR-13100RL)
Re  value 100Ω  [RESC1005X40X25NL05T10]  (hidden comment: RC0402FR-13100RL)
Rf  value 100Ω  [RESC1005X40X25NL05T10]  (hidden comment: RC0402FR-13100RL)
Rg  value 100Ω  [RESC1005X40X25NL05T10]  (hidden comment: RC0402FR-13100RL)

### Ports
Anode (bidir), CA (bidir), CB (bidir), CC (bidir), CD (bidir), CE (bidir), CF (bidir), CG (bidir)

### Nets
Anode: Da.1(+) Db.1(+) Dc.1(+) Dd.1(+) De.1(+) Df.1(+) Dg.1(+) ; port Anode
Cathode_A: Ra.2 ; port CA
Cathode_B: Rb.2 ; port CB
Cathode_C: Rc.2 ; port CC
Cathode_D: Rd.2 ; port CD
Cathode_E: Re.2 ; port CE
Cathode_F: Rf.2 ; port CF
Cathode_G: Rg.2 ; port CG
NetDa_2: Da.2(-) Ra.1
NetDb_2: Db.2(-) Rb.1
NetDc_2: Dc.2(-) Rc.1
NetDd_2: Dd.2(-) Rd.1
NetDe_2: De.2(-) Re.1
NetDf_2: Df.2(-) Rf.1
NetDg_2: Dg.2(-) Rg.1

### Channels
DISPLAY/0: designators end in _0; ports Anode=A0 CA=CA CB=Cathode_B CC=Cathode_C CD=Cathode_D CE=Cathode_E CF=Cathode_F CG=Cathode_G
DISPLAY/1: designators end in _1; ports Anode=A1 CA=CA CB=Cathode_B CC=Cathode_C CD=Cathode_D CE=Cathode_E CF=Cathode_F CG=Cathode_G
DISPLAY/2: designators end in _2; ports Anode=A2 CA=CA CB=Cathode_B CC=Cathode_C CD=Cathode_D CE=Cathode_E CF=Cathode_F CG=Cathode_G
DISPLAY/3: designators end in _3; ports Anode=A3 CA=CA CB=Cathode_B CC=Cathode_C CD=Cathode_D CE=Cathode_E CF=Cathode_F CG=Cathode_G
DISPLAY/4: designators end in _4; ports Anode=A4 CA=CA CB=Cathode_B CC=Cathode_C CD=Cathode_D CE=Cathode_E CF=Cathode_F CG=Cathode_G
DISPLAY/5: designators end in _5; ports Anode=A5 CA=CA CB=Cathode_B CC=Cathode_C CD=Cathode_D CE=Cathode_E CF=Cathode_F CG=Cathode_G
DISPLAY/6: designators end in _6; ports Anode=A6 CA=CA CB=Cathode_B CC=Cathode_C CD=Cathode_D CE=Cathode_E CF=Cathode_F CG=Cathode_G
DISPLAY/7: designators end in _7; ports Anode=A7 CA=CA CB=Cathode_B CC=Cathode_C CD=Cathode_D CE=Cathode_E CF=Cathode_F CG=Cathode_G

### Notes on the sheet
- Green LEDs: WL_SMCW SMT
  Vf = 3.3V, 3000mcd @ 525nm
  If = 20mA, min R = 85Ω
- DWG. NO.
- REV.
- SHT.
- THIS DOCUMENT AND THE DATA DISCLOSED HEREIN OR HEREWITH IS THE PROPERTY OF ALTIUM LIMITED AND MAY BE FREELY DISTRIBUTED IN WHOLE. NO RIGHTS ARE RESERVED OR EXPRESS OR IMPLIED WARANTEE GIVEN.
- REVISION
- DESCRIPTION
- DATE
- APPROVED
- ENG:
- APPROVALS
- PROJECT
- DSN:
- CHK:
- REFERENCE DOCUMENTS
- PROJECT REVISION:
- TITLE
- DOCUMENT REVISION:
- DESIGN ITEM:
- BOM:
- FAB DWG:
- PCB DWG:
- ASSY DWG:
- SCALE:
- SIZE
- B
- CAGE CODE
- FILE NAME
- DWG NO.
- SHEET
- OF
- REV

### Library data of the parts
Da Db Dc Dd De Df Dg = CMP-00009-2: Wl-smcw SMT Mono-color Chip Led
Ra Rb Rc Rd Re Rf Rg = CMP-2002-07853-1: Manufacturer: Yageo; Part Number: RC0402FR-13100RL